# Altium schematic sheet REFCLK.SchDoc: {Наименование}
size 420 x 297 mm; DocumentNumber: ПЛАС.ХХХХХХ.ХХХ ХХ; SheetNumber: {}; SheetTotal: {}; PageSetup: Record=PageOptions|CenterHorizontal=False|CenterVertical=False|PrintScale=0.95|XCorrection=0.00|YCorrection=0.00|PrintKind=1|BorderSize=5000000|LeftOffset=0|BottomOffset=0|Orientation=1|PaperLength=1000|PaperWidth=1000|Scale=100|PaperSource=15|PrintQuality=600|MediaType=1|DitherType=10|PaperKind=A4|PrintScaleMode=1; Rule: PcbType=ProtelPcb
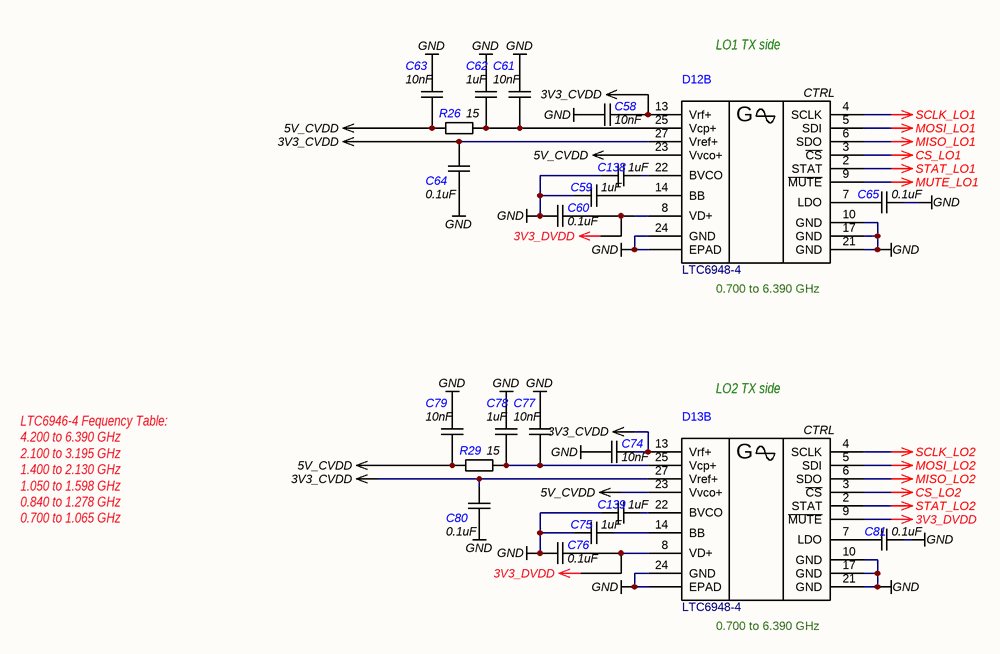
[diagram p0: REFCLK.SchDoc]

## Parts
C58  value 10nF  [C0402]  (hidden comment: CAP)
C59  value 1uF  [C0402]  (hidden comment: CAP)
C60  value 0.1uF  [C0402]  (hidden comment: CAP)
C61  value 10nF  [C0402]  (hidden comment: CAP)
C62  value 1uF  [C0402]  (hidden comment: CAP)
C63  value 10nF  [C0402]  (hidden comment: CAP)
C64  value 0.1uF  [C0402]  (hidden comment: CAP)
C65  value 0.1uF  [C0402]  (hidden comment: CAP)
C74  value 10nF  [C0402]  (hidden comment: CAP)
C75  value 1uF  [C0402]  (hidden comment: CAP)
C76  value 0.1uF  [C0402]  (hidden comment: CAP)
C77  value 10nF  [C0402]  (hidden comment: CAP)
C78  value 1uF  [C0402]  (hidden comment: CAP)
C79  value 10nF  [C0402]  (hidden comment: CAP)
C80  value 0.1uF  [C0402]  (hidden comment: CAP)
C81  value 0.1uF  [C0402]  (hidden comment: CAP)
C138  value 1uF  [C0402]  (hidden comment: CAP)
C139  value 1uF  [C0402]  (hidden comment: CAP)
D12  LTC6948-4  Frequency range: 0.700 to 6.390 GHz  [QFN-28]  (part B of 2)
D13  LTC6948-4  Frequency range: 0.700 to 6.390 GHz  [QFN-28]  (part B of 2)
R26  value 15  [R0603]  (hidden comment: RES)
R29  value 15  [R0603]  (hidden comment: RES)

## Nets
3V3_CVDD: C58.1 C64.2 C74.1 C80.2 D12.13(Vrf+) D12.27(Vref+) D13.13(Vrf+) D13.27(Vref+)
3V3_DVDD: C60.2 C76.2 D12.8(VD+) D13.8(VD+) D13.9(~{MUTE})
5V_CVDD: C63.2 C79.2 D12.23(Vvco+) D13.23(Vvco+) R26.2 R29.2
CS_LO1: D12.3(~{CS})
CS_LO2: D13.3(~{CS})
GND: C58.2 C59.1 C60.1 C61.1 C62.1 C63.1 C64.1 C65.1 C74.2 C75.1 C76.1 C77.1 C78.1 C79.1 C80.1 C81.1 C138.1 C139.1 D12.10(GND) D12.17(GND) D12.21(GND) D12.24(GND) D12.29(EPAD) D13.10(GND) D13.17(GND) D13.21(GND) D13.24(GND) D13.29(EPAD)
MISO_LO1: D12.6(SDO)
MISO_LO2: D13.6(SDO)
MOSI_LO1: D12.5(SDI)
MOSI_LO2: D13.5(SDI)
MUTE_LO1: D12.9(~{MUTE})
SCLK_LO1: D12.4(SCLK)
SCLK_LO2: D13.4(SCLK)
STAT_LO1: D12.2(STAT)
STAT_LO2: D13.2(STAT)
NetC59_2: C59.2 D12.14(BB)
NetC61_2: C61.2 C62.2 D12.25(Vcp+) R26.1
NetC65_2: C65.2 D12.7(LDO)
NetC75_2: C75.2 D13.14(BB)
NetC77_2: C77.2 C78.2 D13.25(Vcp+) R29.1
NetC81_2: C81.2 D13.7(LDO)
NetC138_2: C138.2 D12.22(BVCO)
NetC139_2: C139.2 D13.22(BVCO)

## Notes on the sheet
- LO1 TX side
- LO2 TX side
- LTC6946-4 Fequency Table:
  4.200 to 6.390 GHz
  2.100 to 3.195 GHz
  1.400 to 2.130 GHz
  1.050 to 1.598 GHz
  0.840 to 1.278 GHz
  0.700 to 1.065 GHz
- Подп. и дата
- Инв. № дубл.
- Взам. инв. №
- Инв. № подл.
- Лист
- Изм.
- № докум.
- Подп.
- Дата
- Копировал
- Формат А3
- (in symbol LTC6948, part B) CTRL; G

## Library data of the parts
C58 C61 C63 C74 C77 C79 = CAP: SMD Capacitor; Manufacturer: Murata; Material: X7R; Tolerance: 10%; Voltage: 25V; Type: Ceramic Capacitor; P/N: GRM155R71E103KA01D; Supplier 1: Digi-key; Supplier Part Number 1: 490-1312-1-ND; Supplier 2: Mouser; Supplier Part Number 2: 81-GRM36X103K25; Supplier 3: Farnell; Supplier Part Number 3: *
C59 C62 C75 C78 C138 C139 = CAP: SMD Capacitor; Manufacturer: Murata; Material: X7R; Tolerance: 10%; Voltage: 6.3V; Type: Ceramic Capacitor; P/N: GRM155R70J105KA12J; Supplier 1: Digi-key; Supplier Part Number 1: 490-13339-1-ND; Supplier 2: Mouser; Supplier Part Number 2: 81-GRM155R70J105KA2J; Supplier 3: Farnell; Supplier Part Number 3: *
C60 C64 C65 C76 C80 C81 = CAP: SMD Capacitor; Manufacturer: Murata; Material: X7R; Tolerance: 10%; Voltage: 10V; Type: Ceramic Capacitor; P/N: GRM155R71A104KA01J; Supplier 1: Digi-key; Supplier Part Number 1: 490-6322-1-ND; Supplier 2: Mouser; Supplier Part Number 2: 81-GRM155R71A104KA1J; Supplier 3: Farnell; Supplier Part Number 3: *
D12 D13 = LTC6948: The LTC®LTC6948 is a high performance, low noise, 6.39GHz  phase-locked loop (PLL); Manufacturer: Linear Technology; Voltage: 3.15 V ~ 5.25 V; Type: Clock/Frequency Synthesizer (RF/IF), Integer N; P/N: LTC6948IUFD-4; Package: 28-QFN (4x5); Temperature Range: -40°C ~ 105°C; Supplier 1: Digi-Key; Supplier Part Number 1: 505-LTC6948IUFD-4#PBF-ND; Name: LTC6948-4; Supplier 2: Mouser; Supplier Part Number 2: 584-LTC6948IUFD-4PBF; Supplier 3: Farnell; Supplier Part Number 3: *
R26 R29 = RES: SMD Resistor; Name: Chip SMD Resistor; Power: 0.1 Wt; Tolerance: 1%; P/N: ERJ-3EKF15R0V; Temperature Range: -55…155°C; Supplier 1: Digi-key; Supplier Part Number 1: P15.0HCT-ND; Supplier 2: Mouser; Supplier Part Number 2: 667-ERJ-3EKF15R0V; Supplier 3: Farnell; Supplier Part Number 3: *